# EasyEDA Pro project luoye-microphone-board-2026-08-30.epro

# Schematic MIC
Create Date: 2026-06-14; Page Name: P1; Project Name: AI RECORD; Schematic Name: MIC; Update Date: 2026-06-20; Company: 嘉立创EDA; Page Size: A; Version: V1.0
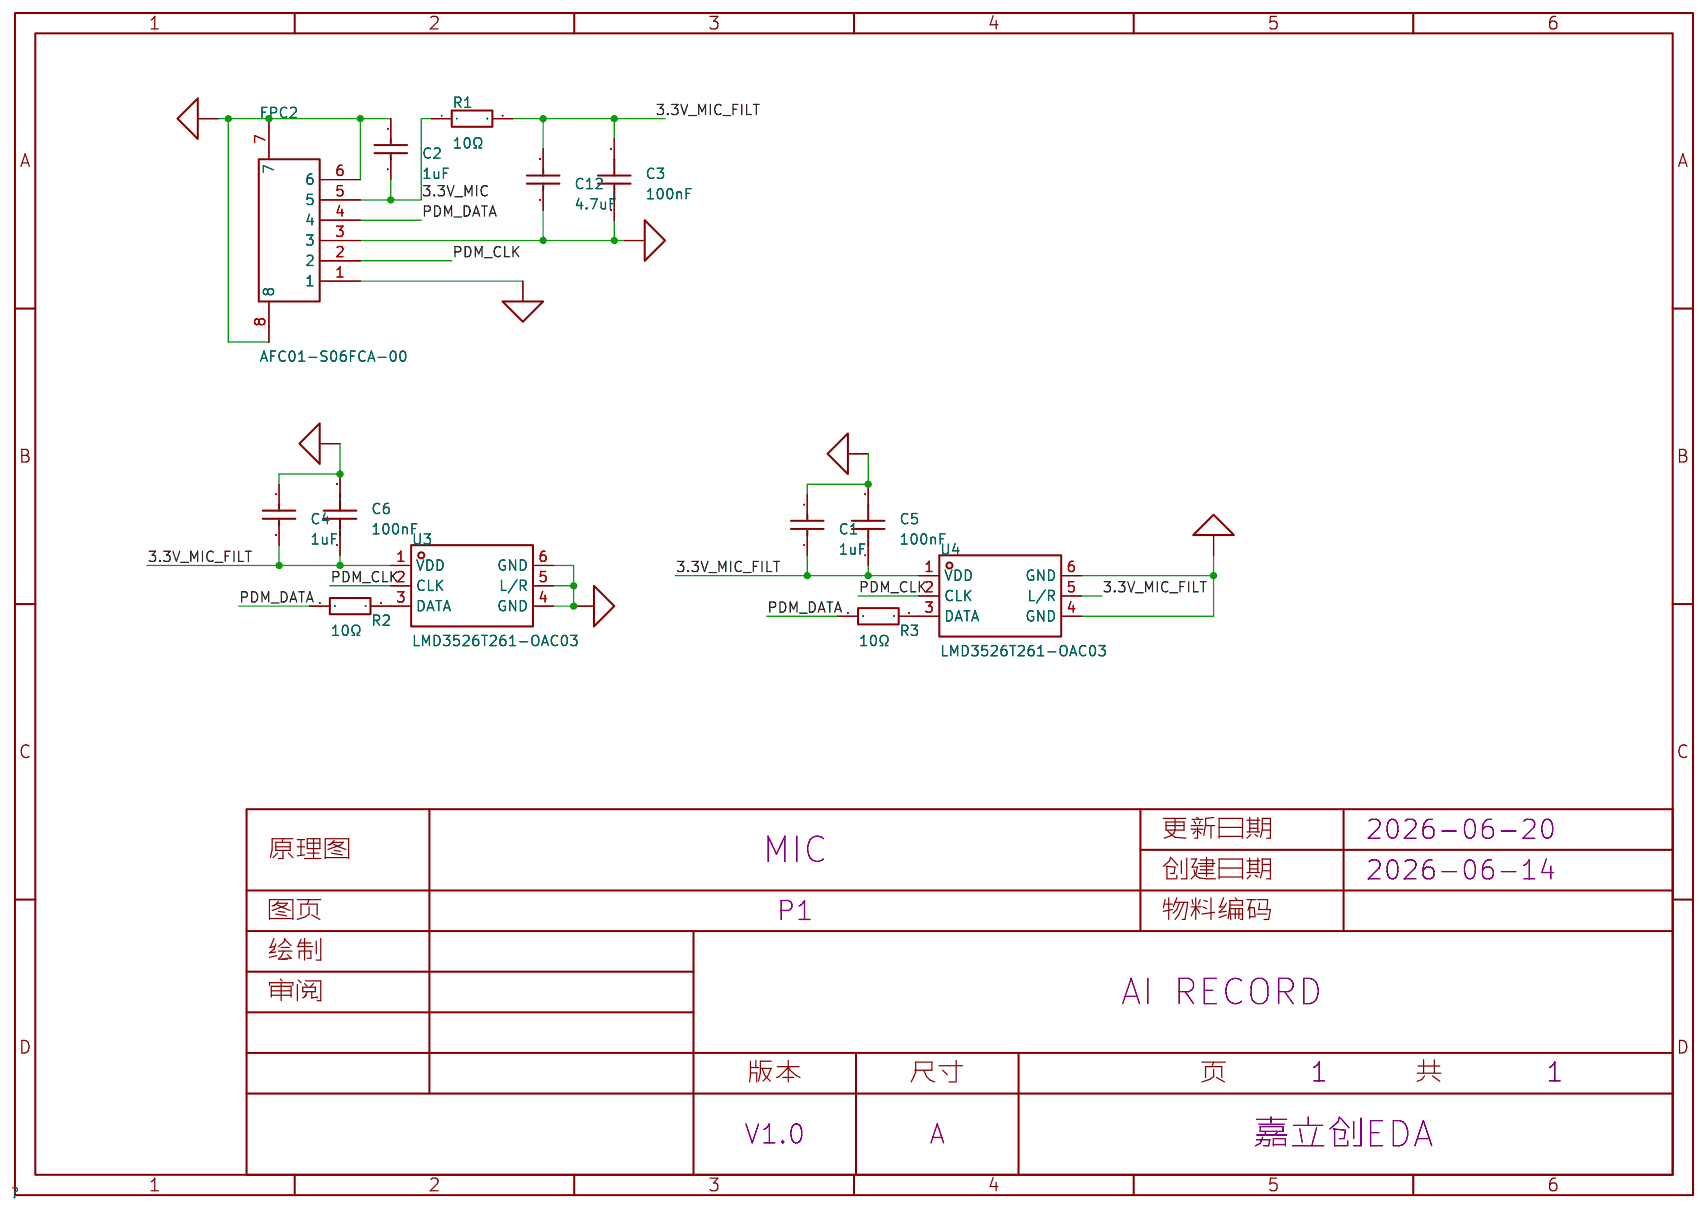
[diagram p0: schematic sheet]

## Parts
C1  1uF  [C0402]
C2  1uF  [C0402]
C3  100nF  [C0402]
C4  1uF  [C0402]
C5  100nF  [C0402]
C6  100nF  [C0402]
C12  4.7uF  [C0805]
FPC2  AFC01-S06FCA-00  [FPC-SMD_P0.50-6P_AFC01-S06FCA-00]
R1  10Ω  [R0805]
R2  10Ω  [R0805]
R3  10Ω  [R0805]
U3  LMD3526T261-OAC03  [MIC-SMD_6P-L3.5-W2.7-P0.884-TR]
U4  LMD3526T261-OAC03  [MIC-SMD_6P-L3.5-W2.7-P0.884-TR]

## Library data of the parts
C1 C2 C4 = CL05A105KO5NNNC: 容值:1uF;精度:±10%;额定电压:16V;温度系数:X5R;; LCSC Part Name: 1uF ±10% 16V; Supplier Part: C29266; Manufacturer: SAMSUNG(三星); Supplier Footprint: 0402; JLCPCB Part Class: Extended Part; Datasheet: https://item.szlcsc.com/datasheet/CL05A105KO5NNNC/30018.html; Supplier: LCSC; Tolerance: ±10%; Voltage Rating: 16V; Temperature Coefficient: X5R
C3 C5 C6 = CL05B104KO5NNNC: 容值:100nF;精度:±10%;额定电压:16V;温度系数:X7R;; LCSC Part Name: 100nF ±10% 16V; Supplier Part: C1525; Manufacturer: SAMSUNG(三星); Supplier Footprint: 0402; JLCPCB Part Class: Basic Part; Datasheet: https://item.szlcsc.com/datasheet/CL05B104KO5NNNC/1877.html; Supplier: LCSC; Tolerance: ±10%; Voltage Rating: 16V; Temperature Coefficient: X7R
C12 = CL21A475KAQNNNE: 容值:4.7uF;精度:±10%;额定电压:25V;温度系数:X5R;; LCSC Part Name: 4.7uF ±10% 25V; Supplier Part: C1779; Manufacturer: SAMSUNG(三星); Supplier Footprint: 0805; JLCPCB Part Class: Basic Part; Datasheet: https://item.szlcsc.com/datasheet/CL21A475KAQNNNE/2131.html; Supplier: LCSC; Tolerance: ±10%; Voltage Rating: 25V; Temperature Coefficient: X5R
FPC2 = AFC01-S06FCA-00: 锁定特性:翻盖式;触点类型:下接;触点数量:6P;间距:0.5mm;安装类型:卧贴;; LCSC Part Name: 间距:0.5mm P数:6P 翻盖式 下接; Supplier Part: C262655; Manufacturer: JS(钜硕电子); Supplier Footprint: SMD,P=0.5mm,卧贴; JLCPCB Part Class: Extended Part; Datasheet: https://atta.szlcsc.com/upload/public/pdf/source/20190816/C413942_2A72D1AC756EAE17EEDF756A339D4500.pdf; Supplier: LCSC; Locking Feature: 翻盖式; Contact Type: 下接; Number of Contacts: 6P; Pitch: 0.5mm; Mounting Type: 卧贴; FFC, FCB Thickness: 0.3mm; Height Above Board: 2mm
R1-R3 = RC0805FR-0710RL: 电阻类型:厚膜电阻;阻值:10Ω;精度:±1%;功率:125mW;工作电压:150V;温度系数:±200ppm/℃;; LCSC Part Name: 厚膜电阻 10Ω ±1% 125mW; Supplier Part: C96347; Manufacturer: YAGEO(国巨); Supplier Footprint: 0805; JLCPCB Part Class: Extended Part; Datasheet: https://item.szlcsc.com/datasheet/RC0805FR-0710RL/97551.html; Supplier: LCSC; Type: 厚膜电阻; Tolerance: ±1%; Power(Watts): 125mW; Voltage-Supply(Max): 150V; Temperature Coefficient: ±200ppm/℃; Operating Temperature: -55℃~+155℃
U3 U4 = LMD3526T261-OAC03: 方向:全指向;灵敏度:-26dB;; LCSC Part Name: MEMSmic数字硅麦3526 上进音 s-26db±1 snr61db LMD:聆麦数字麦克风/3526:尺寸/T:上进音/261:-26±1dB; Supplier Part: C7587899; Manufacturer: LinkMems(聆麦声学); Supplier Footprint: SMD-6P,3.5x2.7mm; JLCPCB Part Class: Extended Part; Datasheet: https://atta.szlcsc.com/upload/public/pdf/source/20240604/F0735E7E9B0FCDCA92015CC5CA9EAE15.pdf; Supplier: LCSC; Direction: 全指向; Supply Voltage: 1.62V~3.6V; Current Consumption: 750uA; Sensitivity: -26dB

## Nets
3.3V_MIC: C2.2 FPC2.5 R1.1
3.3V_MIC_FILT: C1.1 C3.2 C4.1 C5.1 C6.1 C12.2 R1.2 U3.1(VDD) U4.1(VDD) U4.5(L/R)
AGND: C1.2 C2.1 C3.1 C4.2 C5.2 C6.2 C12.1 FPC2.1 FPC2.3 FPC2.6 FPC2.7 FPC2.8 U3.4(GND) U3.5(L/R) U3.6(GND) U4.4(GND) U4.6(GND)
PDM_CLK: FPC2.2 U3.2(CLK) U4.2(CLK)
PDM_DATA: FPC2.4 R2.1 R3.1
$1N34: R3.2 U4.3(DATA)
$1N35: R2.2 U3.3(DATA)

# Board MIC
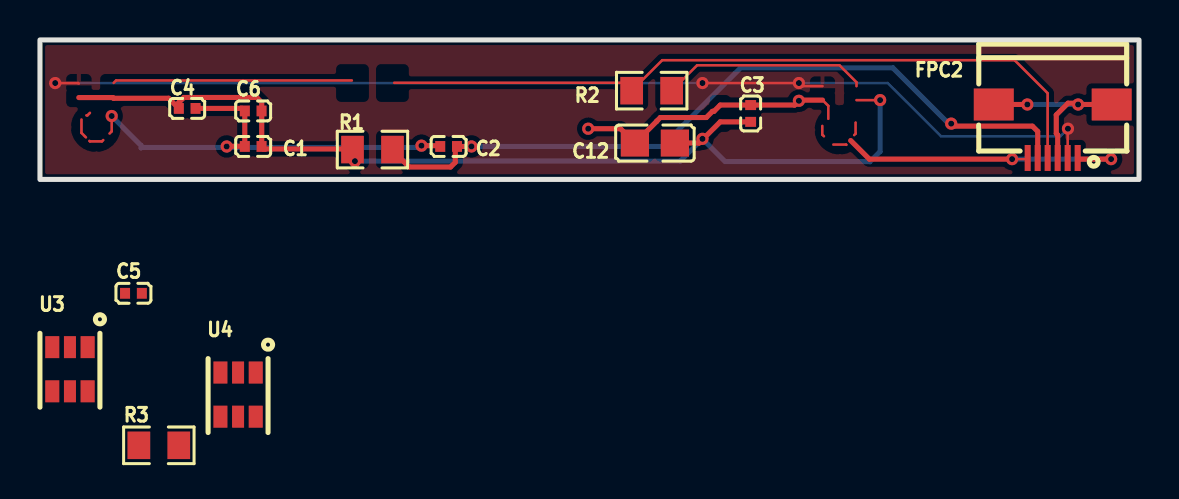
[diagram p1: board, top side]
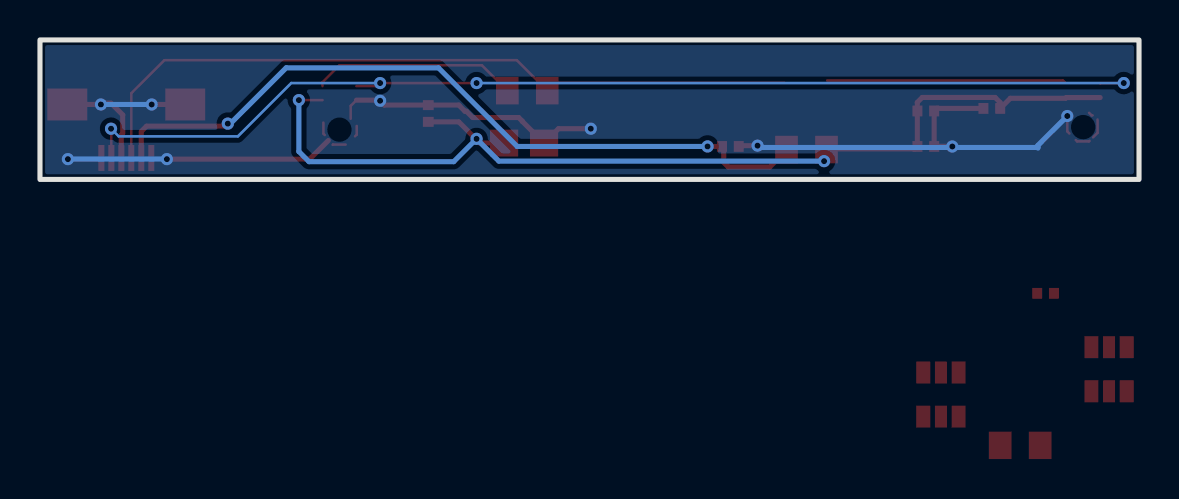
[diagram p2: board, bottom side, seen from below]

Outline 54.99 x 6.98 mm; copper layers: Top Layer, Bottom Layer. Coordinates in mm from the lower left corner of the outline.
Outline path: rectangle 0,6.98 54.99,0
Stack: Top Layer 0.035mm / Dielectric1 1.51mm FR4 er 4.5 / Bottom Layer 0.035mm

## Design rules (mm)
spacing copperThickness1oz (default): track to track 0.102, other pairs 0.152 to 0.3
spacing copperThickness2oz: track to track 0.203, other pairs 0.152 to 0.3
spacing Plane_innerPlane: track to track 0.102, other pairs 0.152 to 0.3
spacing Copper_copperRegion: track to track 0.102, other pairs 0.152 to 0.3
track width copperThickness1oz (default): min 0.127, default 0.254, max 2.54
track width copperThickness2oz: min 0.203, default 0.254, max 2.54
differential pair differentialPair (default): width min 0.127, default 0.254, max 2.54; gap min 0.152, default 0.152
net AGND uses copperRegion_copperThickness1oz
net PDM_CLK uses copperRegion_copperThickness1oz
pour e177 uses Copper_copperRegion, copperRegion_Copper_copperRegion
pour e181 uses Copper_copperRegion, copperRegion_Copper_copperRegion

## Placement (name value [footprint] x y rotation side)
C1  1uF  [C0402]  10.67 1.65 180 top
C2  1uF  [C0402]  20.45 1.65 0 top
C3  100nF  [C0402]  35.56 3.3 270 top
C4  1uF  [C0402]  7.37 3.56 0 top
C5  100nF  [C0402]  4.68 -5.7 0 top
C6  100nF  [C0402]  10.67 3.43 0 top
C12  4.7uF  [C0805]  30.77 1.82 0 top
FPC2  AFC01-S06FCA-00  [FPC-SMD_P0.50-6P_AFC01-S06FCA-00]  50.67 2.41 180 top
R1  10Ω  [R0805]  16.64 1.49 180 top
R2  10Ω  [R0805]  30.61 4.45 0 top
R3  10Ω  [R0805]  5.95 -13.32 0 top
U3  LMD3526T261-OAC03  [MIC-SMD_6P-L3.5-W2.7-P0.884-TR]  1.5 -9.51 0 top
U4  LMD3526T261-OAC03  [MIC-SMD_6P-L3.5-W2.7-P0.884-TR]  9.91 -10.78 0 top

## Footprints (pads in the part's own frame, mm; a bottom-side part is the same pattern mirrored in y, then rotated)
C0402
  rect 0.5x0.54 smd: 1(-0.42,0) 2(0.42,0)
C0805
  rect 1.41x1.35 smd: 1(-1,0) 2(1,0)
FPC-SMD_P0.50-6P_AFC01-S06FCA-00
  rect 0.3x1.3 smd: 1(-1.248,1.339) 2(-0.748,1.339) 3(-0.248,1.339) 4(0.252,1.339) 5(0.752,1.339) 6(1.252,1.339)
  rect 2x1.6 smd: 7(-2.95,-1.339) 8(2.95,-1.339)
MIC-SMD_6P-L3.5-W2.7-P0.884-TR
  rect 0.7x1.1 smd: 1(0.884,1.105) 3(-0.884,1.105) 4(-0.884,-1.105) 6(0.884,-1.105)
  rect 0.6x1.1 smd: 2(0,1.105) 5(0,-1.105)
R0805
  rect 1.133x1.377 smd: 1(-1,0) 2(1,0)

## Nets
As in the schematic.

## Via types
v1: diameter 0.61, hole 0.305, Top Layer to Bottom Layer, 18 vias

## Routing (per net, layer and track width the routed paths; a pad name or vN(x,y) marks a point on that pad's centre or on a via; arc(x,y) is an arc through that point)
3.3V_MIC: length 37.1
  Top Layer w0.254: 20.78,1.44 20.78,0.86 20.55,0.62 18.47,0.62 17.9,1.2 ; C2.2 v1(21.59,1.65) ; v1(45.59,2.79) 45.72,2.67 49.66,2.67 49.92,2.4 FPC2.5
  Bottom Layer w0.254: v1(21.59,1.65) 31.11,1.65 35.05,5.59 42.67,5.59 45.47,2.79 v1(45.59,2.79)
3.3V_MIC_FILT: length 51.8
  Top Layer w0.127: 40.86,3.97 v1(42.04,3.97)
  Top Layer w0.254: 11.09,1.66 11.09,3.86 10.85,4.11 7.2,4.11 6.95,3.85 C4.1 6.44,4.06 3.68,4.06 3.64,4.1 1.94,4.1 ; 11.14,1.53 15.34,1.53 15.42,1.61 ; C3.2 34.04,2.88 32.97,1.82 C12.2
  Bottom Layer w0.254: v1(15.76,0.92) 32.03,0.92 v1(33.15,2.03) 34.29,0.89 41.53,0.89 42.04,1.4 v1(42.04,3.97)
AGND: length 66.1
  Top Layer w0.127: 39.7,1.75 40.33,1.75 40.35,1.73 ; 40.81,2.85 40.81,2.29 40.74,2.22 ; 2.08,3 2.08,2.33 2.3,2.11 ; 2.32,3.21 2.37,3.21 2.5,3.33 ; FPC2.6 49.36,1.02 v1(48.64,1.02) ; 2.47,1.93 2.5,1.91 3.1,1.91 3.16,1.97 ; 39.14,2.68 39.14,2.24 39.23,2.16 ; 3.48,2.3 3.59,2.4 v1(3.59,3.17) 3.59,3.19 3.54,3.24 ; 39.45,3.04 39.45,3.68 39.16,3.97
  Top Layer w0.254: v1(27.43,2.54) 29.05,2.54 C12.1 30.86,2.91 30.86,2.92 31.04,3.1 33.34,3.1 33.65,3.41 33.73,3.41 34.04,3.72 C3.1 37.76,3.72 v1(37.97,3.94) 38.01,3.97 39.16,3.97 ; C1.2 10.25,3.43 10.12,3.56 7.79,3.56 ; FPC2.8 v1(49.4,3.75) ; FPC2.3 50.92,2.23 50.85,2.3 50.85,3.23 51.44,3.82 51.88,3.82 v1(51.94,3.75) FPC2.7 ; 9.28,1.64 9.3,1.66 10.02,1.66 ; v1(48.64,1.02) 41.5,1.02 40.57,1.95 ; FPC2.1 51.98,1.02 v1(53.59,1.02) ; 19.95,1.69 v1(19.09,1.69)
  Bottom Layer w0.254: 18.91,1.6 9.35,1.6 9.33,1.61 ; v1(49.4,3.75) v1(51.94,3.75) ; v1(3.59,3.17) 5.06,1.7 5.06,1.6 ; 5.06,1.6 9.33,1.6 ; 5.06,1.6 5.06,1.56 ; v1(48.64,1.02) v1(53.59,1.02)
  vias: v1(9.34,1.65)
PDM_CLK: length 55.8
  Top Layer w0.127: 1.94,4.8 1.92,4.83 v1(0.76,4.83) ; v1(51.44,2.54) 51.42,2.53 FPC2.2 ; 39.16,4.67 38.13,4.67 v1(37.97,4.83) v1(33.15,4.83)
  Bottom Layer w0.127: v1(37.97,4.83) 42.42,4.83 45.08,2.16 51.05,2.16 v1(51.44,2.54) ; v1(0.76,4.83) v1(33.15,4.83)
PDM_DATA: length 37.4
  Top Layer w0.127: FPC2.4 50.42,1.08 50.42,4.32 48.77,5.97 31.13,5.97 R2.1 29.21,4.84 17.72,4.84
$1N28: length 10.3
  Top Layer w0.127: 31.61,4.45 32.88,5.72 40.01,5.72 40.86,4.86 40.86,4.67
$1N31: length 12
  Top Layer w0.127: 3.69,4.84 3.81,4.96 15.6,4.96

## Copper pours and planes (outline as drawn; the poured copper is in the pictures)
AGND on Bottom Layer: 0.04,7.01 55.08,7.01 55.08,0 0.04,0
PDM_CLK on Top Layer: 0.1,6.98 54.94,6.98 54.94,-0.07 0.1,-0.07
